# Altium project RYA_ESC.PrjPcb (part 2 of 2)

## Sheet StepDown.SchDoc
size B; SheetNumber: 10; SheetTotal: 15; SPICEModelCacheKQMKTCIF: <root> / <DocumentId>KQMKTCIF</DocumentId> / </root>
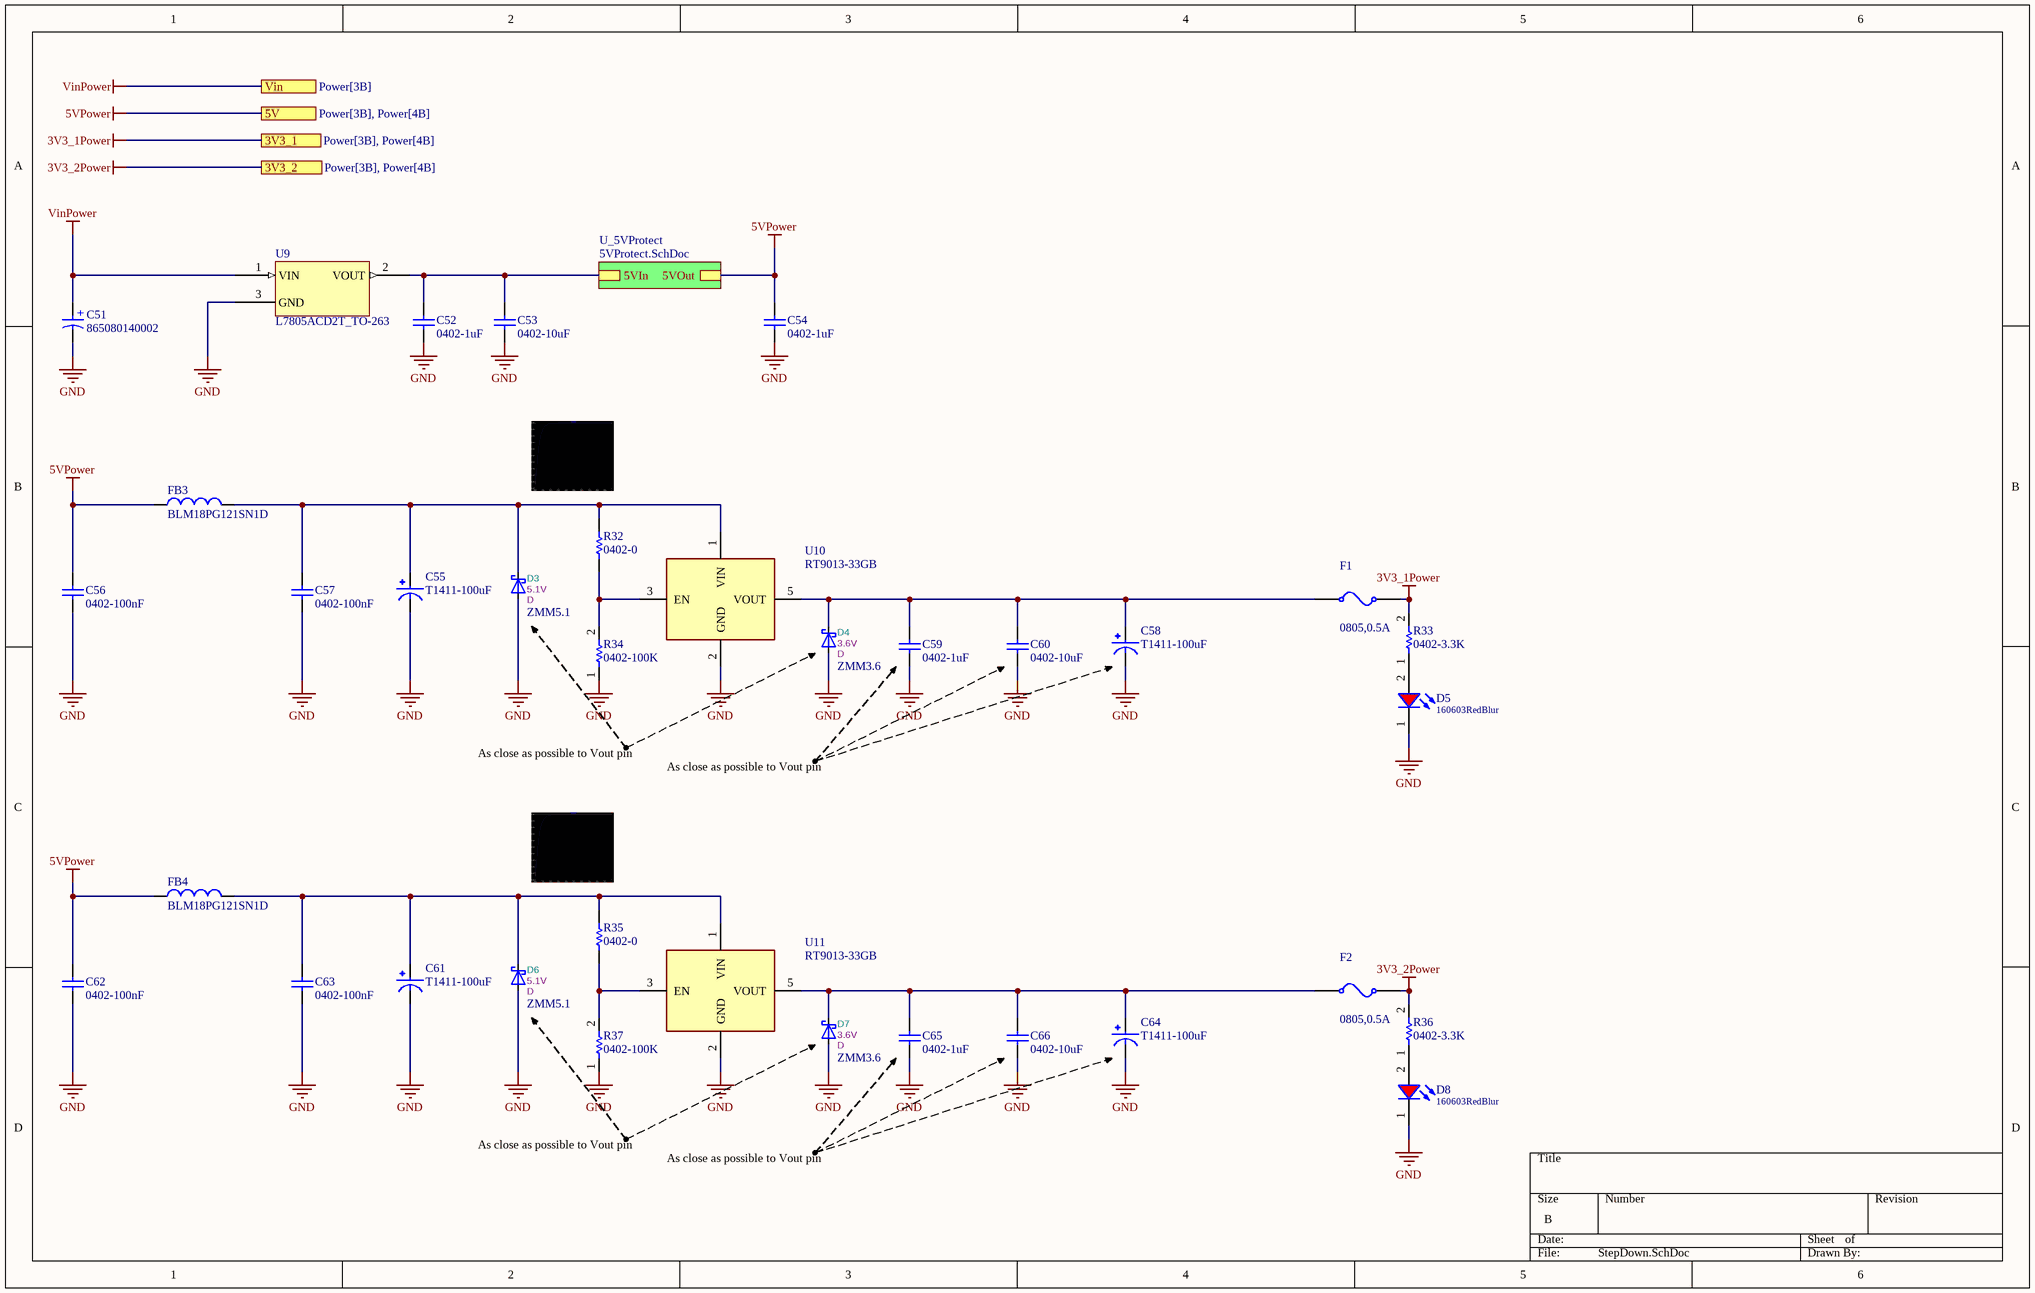
[diagram p8: StepDown.SchDoc]

### Parts
C51  865080140002  [WCAP-ASLI_D4H5.5]
C52  0402-1uF  [CAPC0402(1005)60_N]
C53  0402-10uF  [CAPC0402(1005)60_N]
C54  0402-1uF  [CAPC0402(1005)60_N]
C55  T1411-100uF  [CAPPC3528X210N]
C56  0402-100nF  [CAPC0402(1005)60_N]
C57  0402-100nF  [CAPC0402(1005)60_N]
C58  T1411-100uF  [CAPPC3528X210N]
C59  0402-1uF  [CAPC0402(1005)60_N]
C60  0402-10uF  [CAPC0402(1005)60_N]
C61  T1411-100uF  [CAPPC3528X210N]
C62  0402-100nF  [CAPC0402(1005)60_N]
C63  0402-100nF  [CAPC0402(1005)60_N]
C64  T1411-100uF  [CAPPC3528X210N]
C65  0402-1uF  [CAPC0402(1005)60_N]
C66  0402-10uF  [CAPC0402(1005)60_N]
D3  ZMM5.1  value 5.1V  Reference: D  [SOD-80_MiniMELF_Glass]
D4  ZMM3.6  value 3.6V  Reference: D  [SOD-80_MiniMELF_Glass]
D5  160603RedBlur  [WL-SMCW_0603_H=0.7mm]
D6  ZMM5.1  value 5.1V  Reference: D  [SOD-80_MiniMELF_Glass]
D7  ZMM3.6  value 3.6V  Reference: D  [SOD-80_MiniMELF_Glass]
D8  160603RedBlur  [WL-SMCW_0603_H=0.7mm]
F1  0805,0.5A  [Fuse_SMD_0805]
F2  0805,0.5A  [Fuse_SMD_0805]
FB3  BLM18PG121SN1D  [FP-BLM18-0_15-t0_8-MFG]
FB4  BLM18PG121SN1D  [FP-BLM18-0_15-t0_8-MFG]
R32  0402-0  [R-0402-1K]
R33  0402-3.3K  [R-0402-10K]
R34  0402-100K  [R-0402-10K]
R35  0402-0  [R-0402-1K]
R36  0402-3.3K  [R-0402-10K]
R37  0402-100K  [R-0402-10K]
U9  L7805ACD2T_TO-263  [TO-263]
U10  RT9013-33GB  [SOT94P279X129-5N]
U11  RT9013-33GB  [SOT94P279X129-5N]

### Sub-sheets
U_5VProtect = 5VProtect.SchDoc: 5VIn, 5VOut

### Ports
3V3_1 (see Power[3B], Power[4B]), 3V3_2 (see Power[3B], Power[4B]), 5V (see Power[3B], Power[4B]), Vin (see Power[3B])

### Nets
3V3_1Power: F1.1 R33.2 ; port 3V3_1
3V3_2Power: F2.1 R36.2 ; port 3V3_2
5VPower: C54.2 C56.2 C62.2 FB3.1 FB4.1 ; port 5V, sheet U_5VProtect/5VOut
GND: C51.2(N) C52.1 C53.1 C54.1 C55.2 C56.1 C57.1 C58.2 C59.1 C60.1 C61.2 C62.1 C63.1 C64.2 C65.1 C66.1 D3.A D4.A D5.1(K) D6.A D7.A D8.1(K) R34.1 R37.1 U9.3(GND) U10.2(GND) U11.2(GND)
VinPower: C51.1(P) U9.1(VIN) ; port Vin
NetC52_2: C52.2 C53.2 U9.2(VOUT) ; sheet U_5VProtect/5VIn
NetC55_1: C55.1 C57.2 D3.K FB3.2 R32.2 U10.1(VIN)
NetC58_1: C58.1 C59.2 C60.2 D4.K F1.0 U10.5(VOUT)
NetC61_1: C61.1 C63.2 D6.K FB4.2 R35.2 U11.1(VIN)
NetC64_1: C64.1 C65.2 C66.2 D7.K F2.0 U11.5(VOUT)
NetD5_2: D5.2(A) R33.1
NetD8_2: D8.2(A) R36.1
NetR32_1: R32.1 R34.2 U10.3(EN)
NetR35_1: R35.1 R37.2 U11.3(EN)

### Notes on the sheet
- As close as possible to Vout pin
- (in symbol CMP-014-00008-1) +

### Library data of the parts
C51 = CMP-014-00008-1: V-Chip, D4 x H5.8mm, 47uF, 6.3V; Manufacturer: Wurth Elektronik; Endurance: 2000h; Leakage Current: 3uA; Ripple Current: 86mA; Dissipation Factor: 24%; Capacitance Tolerance: +/-20%; Capacitance: 47µF; Pins: 2; Supplier 2 URL: N/A; Diameter: 4mm; Design Item ID: 865080140002; Supplier 1 SN: 710-865080140002; Operating Temperature Max: 105°C; Supplier 1 Name: Mouser; Source: Al_Cap.SchLib; Packaging: Tape and Reel; Supplier 2 Name: Digi-Key; Supplier 3 Name: thegioiic; Manufacturer Part Number: N/A; Supplier 2 SN: N/A; Rated Voltage (DC): 6.3V; Height: 5.5mm; Operating Temperature Min: -55°C; Value: 47uF, 6.3V; Supplier 1 URL: https://www.mouser.vn/ProductDetail/Wurth-Elektronik/865080140002?qs=0KOYDY2FL2%252BjKlezJ2boQA%3D%3D; Supplier 3 URL: https://www.thegioiic.com/tu-nhom-smd-47uf-6-3v-5x5-4mm; Category: Aluminum Electrolytic Capacitors; Mount: Surface Mount; Supplier 3 SN: EEEHB0J330AR; Component Type: Standard
C52 C54 C59 C65 = CMP-001-00353-3: Capacitor 1uF 0402s; Voltage Rating: 4V; Value: 1µF; Tolerance: 20%; Dielectric: X5R; Pins: 2; Component Type: Standard; Packaging: Tape and Reel; Min Operating Temperature: -55°C; Voltage Rating (DC): 4V; Series: M; Height: 0.5mm; RoHS Compliant: Yes; Case/Package: 0402; Thickness: 0.028inch; Design Item ID: CMP-1034-02139-2; Length: 0.039inch; Max Operating Temperature: 85°C; Termination: SMD/SMT; Package Quantity: 1; Width: 0.02inch; Halogen Free: Halogen Free; Source: 0402-10uF.SchLib; Construction: Flat; Mount: Surface Mount; Case Code (Metric): 1005
C53 C60 C66 = CMP-001-00352-3: Capacitor 10uF 0402s; Tolerance: 20%; Value: 10µF; Dielectric: X5R; Voltage Rating (DC): 4V; Width: 0.02inch; Packaging: Tape and Reel; RoHS Compliant: Yes; Series: M; Mount: Surface Mount; Termination: SMD/SMT; Source: 0402-10uF.SchLib; Design Item ID: CMP-1034-02139-2; Min Operating Temperature: -55°C; Construction: Flat; Component Type: Standard; Case Code (Metric): 1005; Length: 0.039inch; Height: 0.5mm; Pins: 2; Thickness: 0.028inch; Voltage Rating: 4V; Package Quantity: 1; Max Operating Temperature: 85°C; Halogen Free: Halogen Free; Case/Package: 0402
C55 C58 C61 C64 = CMP-001-00373-1: 100µF Molded Tantalum Polymer Capacitor 25 V 1411 (3528 Metric), 1210 150mOhm @ 100kHz; MF: AVX; MP: TCJB106M025R0150; Check_prices: https://www.snapeda.com/parts/TCJB106M025R0150/AVX/view-part/?ref=eda; Component Type: Standard; Value: 100µF; SnapEDA_Link: https://www.snapeda.com/parts/TCJB106M025R0150/AVX/view-part/?ref=snap; Pins: 2; Case/Package: 1210 AVX; Design Item ID: TCJB106M025R0150; Source: TCJB106M025R0150.SchLib
C56 C57 C62 C63 = CMP-001-00354-3: Capacitor 100nF 0402; Tolerance: 20%; Voltage Rating (DC): 4V; Dielectric: X5R; Series: M; RoHS Compliant: Yes; Max Operating Temperature: 85°C; Length: 0.039inch; Thickness: 0.028inch; Mount: Surface Mount; Min Operating Temperature: -55°C; Height: 0.5mm; Packaging: Tape and Reel; Construction: Flat; Termination: SMD/SMT; Source: 0402-10uF.SchLib; Design Item ID: CMP-1034-02139-2; Case/Package: 0402; Voltage Rating: 4V; Pins: 2; Value: 100nF; Width: 0.02inch; Component Type: Standard; Package Quantity: 1; Halogen Free: Halogen Free; Case Code (Metric): 1005
D3 D6 = CMP-004-00117-3: ki_keywords: Zener; Design Item ID: Zener; Pins: 2; Datasheet: https://diotec.com/de/produktliste/SBD.html; Component Type: Standard; Source: schottky-diode.SchLib; ki_description: Zener
D4 D7 = CMP-004-00123-1: ZenerDiode 3.6V; ki_description: Zener; Pins: 2; Design Item ID: Zener; Component Type: Standard; Source: schottky-diode.SchLib; ki_keywords: Zener; Datasheet: https://diotec.com/de/produktliste/SBD.html
D5 D8 = CMP-004-00093-1: WL-SMCW SMT Mono-color Chip LED Blur, size 0603, Red, 2V, 140deg; Value: Red, 2V; ComponentLink2URL: https://www.mouser.vn/ProductDetail/ROHM-Semiconductor/CSL1901VW1?qs=vvQtp7zwQdNmrXZcE27xEA%3D%3D; Supplier 2 URL: https://www.digikey.com/en/products/detail/rohm-semiconductor/SML-D12U8WT86/1641799; Pins: 2; Supplier 2 Name: Digi-Key; ComponentLink1Description: Datasheet link; ComponentLink3URL: https://www.digikey.com/en/products/detail/rohm-semiconductor/SML-D12U8WT86/1641799; Supplier 1 Name: Mouser; Supplier 1 SN: 755-CSL1901VW1; Size: 0603; ComponentLink1URL: N/A; Source: WL-SMCW_0603.SchLib; ComponentLink3Description: Supplier 2 URL; Type: Blur; Design Item ID: 160603RedBlur; Component Type: Standard; ComponentLink4URL: N/A; Supplier 3 Name: ICDayRoi; Supplier 3 SN: N/A; Color: Red; Supplier 1 URL: https://www.mouser.vn/ProductDetail/ROHM-Semiconductor/CSL1901VW1?qs=vvQtp7zwQdNmrXZcE27xEA%3D%3D; Supplier 2 SN: 511-1580-2-ND; ComponentLink2Description: Supplier 1 URL; Supplier 3 URL: N/A; ComponentLink4Description: Supplier 3 URL
F1 F2 = CMP-005-00046-1: Resettable Fuse, Size 0805, 6V, 0.5A; Manufacturer: Littelfuse; Threshold Current: 100A; Trip Current: 1A; Supplier 1 Name: Mouser; ComponentLink3URL: https://www.digikey.com/en/products/detail/littelfuse-inc/0805L050WR/1212822?s=N4IgTCBcDaIAwA44FYAyK4HUBKACEAugL5A; Component Type: Standard; Design Item ID: 060805050006; ComponentLink1Description: Datasheet link; ComponentLink2Description: Supplier 1 URL; Supplier 2 Name: Digi-Key; ComponentLink4URL: https://www.thegioiic.com/0805l050wr-cau-chi-tu-phuc-hoi-0805-6v-500ma; Size: 0805; Hold Current: 0.5A; Supplier 2 URL: https://www.mouser.vn/ProductDetail/Littelfuse/0805L050WR?qs=SJZ%252BTX%252BI2BS1ufZ22HRodg%3D%3D; Supplier 2 SN: F2772TR-ND; Threshold Voltage: 6V; ComponentLink4Description: Supplier 3 URL; Source: Fuse_SMD.SchLib; Supplier 3 SN: 0805L050WR; ComponentLink3Description: Supplier 2 URL; Mounting Technology: SMT/SMD; Supplier 3 Name: thegioiic; ComponentLink1URL: https://www.littelfuse.com/~/media/electronics/datasheets/resettable_ptcs/littelfuse_ptc_0805l_datasheet.pdf.pdf; Supplier 3 URL: https://www.thegioiic.com/0805l050wr-cau-chi-tu-phuc-hoi-0805-6v-500ma; Supplier 1 SN: 576-0805L050; ComponentLink2URL: https://www.mouser.vn/ProductDetail/Littelfuse/0805L050WR?qs=SJZ%252BTX%252BI2BS1ufZ22HRodg%3D%3D; Supplier 1 URL: https://www.mouser.vn/ProductDetail/Littelfuse/0805L050WR?qs=SJZ%252BTX%252BI2BS1ufZ22HRodg%3D%3D; Value: 6V,  0.5A; Pins: 2
FB3 FB4 = CMP-006-00234-2: Ferrite Chip, 1 Function(s), 2A, 2 Pin(s); DC Resistance-Max: 50mR; Max Operating Temperature: 125°C; Packaging: Tape and Reel; Material: Ferrite; Min Operating Temperature: -55°C; RoHS Compliant: Yes; Current Rating: 2A; Height: 0.8mm; Length: 1.6mm; Width: 0.8mm
R32 R35 = CMP-009-00678-4: 0402Resistor 0 Ohm; Value: 0
R33 R36 = CMP-009-00688-1: RES 0402 3.3K; Value: 3.3k
R34 R37 = CMP-009-00683-1: RES 0402 100K; Value: 100k
U9 = CMP-098-000007-1: Out: 5V, 1.5A; In: 7V to 35V; Pacakge: TO-263; Supplier 2 URL: https://www.digikey.com/en/products/detail/stmicroelectronics/L7805ACD2T-TR/1038230; Supplier 2 SN: 497-7253-2-ND; Package: TO-263; Component Type: Standard; Voltage Input Maximum: 7V to 35V; Output Current: 1.5A; Design Item ID: L7805ACD2T_TO-263; Supplier 3 SN: N/A; ComponentLink4Description: Supplier 3 URL; ComponentLink4URL: https://www.thegioiic.com/l7805acd2t-ic-on-ap-5v-1-5a; Supplier 1 URL: https://www.mouser.com/ProductDetail/STMicroelectronics/L7805ACD2T-TR?qs=Ctxo64yJVFuOLXlPPZdJUQ%3D%3D; Supplier 3 URL: https://www.thegioiic.com/l7805acd2t-ic-on-ap-5v-1-5a; Value: 5V, 1.5A; Pin Count: 3; Supplier 2 Name: Digi-Key; ComponentLink1Description: Datasheet link; Voltage Output: 5V; ComponentLink3Description: Supplier 2 URL; Supplier 1 SN: 511-L7805ACD2T-TR; ComponentLink3URL: https://www.digikey.com/en/products/detail/stmicroelectronics/L7805ACD2T-TR/1038230; Supplier 3 Name: thegioiic; ComponentLink2URL: https://www.mouser.com/ProductDetail/STMicroelectronics/L7805ACD2T-TR?qs=Ctxo64yJVFuOLXlPPZdJUQ%3D%3D; Source: 78xx.SchLib; ComponentLink2Description: Supplier 1 URL; Supplier 1 Name: Mouser; ComponentLink1URL: https://www.st.com/resource/en/datasheet/l78.pdf
U10 U11 = CMP-149-000001-2: Linear Voltage Regulator IC Positive Fixed 1 Output 500mA TSOT-23-5; MF: Richtek USA; Design Item ID: RT9013-33GB; SnapEDA_Link: https://www.snapeda.com/parts/RT9013-33GB/Richtek/view-part/?ref=snap; Source: RT9013-33GB.SchLib; Component Type: Standard; Pin Count: 4; Check_prices: https://www.snapeda.com/parts/RT9013-33GB/Richtek/view-part/?ref=eda; MP: RT9013-33GB; Package: SOT-23-5 Richtek; Value: *

## Sheet 5VProtect.SchDoc
size B; SheetNumber: 11; SheetTotal: 15
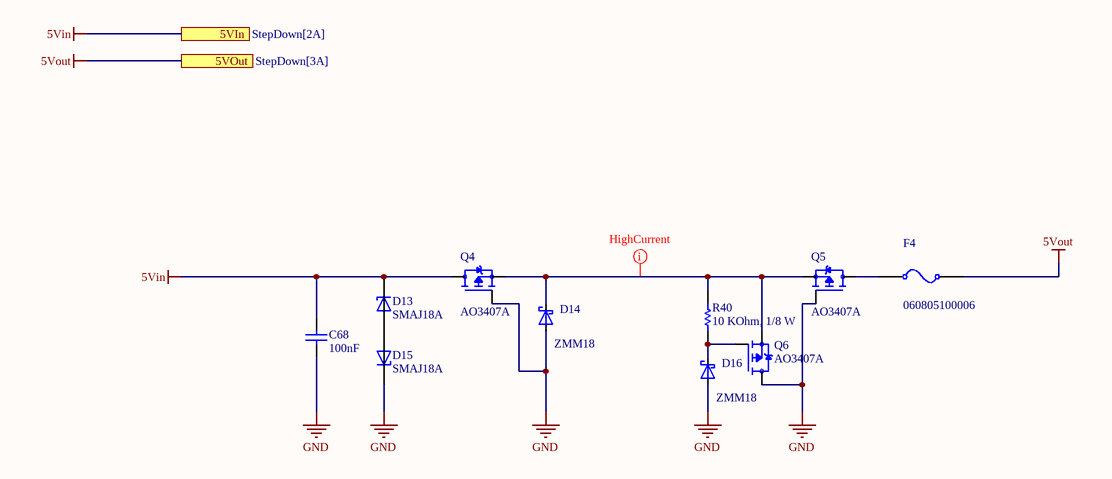
[diagram p9: 5VProtect.SchDoc]

### Parts
C68  value 100nF  [CAP_0805]  (hidden comment: 0108051041050)
D13  SMAJ18A  [DIOM4325X250N]
D14  ZMM18  [SOD-80_MiniMELF_Glass]
D15  SMAJ18A  [DIOM4325X250N]
D16  ZMM18  [SOD-80_MiniMELF_Glass]
F4  060805100006  [Fuse_SMD_0805]
Q4  AO3407A  [SOT95P280X125-3N]
Q5  AO3407A  [SOT95P280X125-3N]
Q6  AO3407A  [SOT95P280X125-3N]
R40  value 10 KOhm, 1/8 W  [RESISTOR_0805]  (hidden comment: 0008051031)

### Ports
5VIn (see StepDown[2A]), 5VOut (see StepDown[3A])

### Nets
5Vin: C68.2 D13.C Q4.3(D) ; port 5VIn
5Vout: F4.1 ; port 5VOut
GND: C68.1 D14.A D15.C D16.A Q4.1(G) Q5.1(G) Q6.3(D)
NetD13_A: D13.A D15.A
NetD14_K: D14.K Q4.2(S) Q5.2(S) Q6.2(S) R40.2
NetD16_K: D16.K Q6.1(G) R40.1
NetF4_0: F4.0 Q5.3(D)

### Layout directives
rule Width Constraint [Pref Width = 0.508mm    Min Width = 0.127mm    Max Width = 25.4mm]: NetD14_K

### Library data of the parts
C68 = CMP-001-00259-1: CAP, size 0805, 0.1 nF, 50 VDC; Manufacture Name: TDK; Manufacture SN: CGA4J2X8R1H104K125AD; Voltage Rating DC: 50 VDC; Tolerance: 10%; Pins: 2; Supplier 2 URL: https://www.digikey.com/en/products/detail/tdk-corporation/cga4j2x8r1h104k125ad/3248169; Supplier 1 SN: 810-C2012X8R1H104KEP; Supplier 1 Name: Mouser; Supplier 3 Name: thegioiic; Mounting Technology: SMT; Source: Capacitor_0805_10_percent.SchLib; Supplier 2 SN: 445-8810-2-ND; Supplier 3 SN: OEM; Operating Temperature: -55 to +125degC; Supplier 2 Name: Digi-Key; Component Type: Standard; Design Item ID: 0108051041050; Supplier 1 URL: https://www.mouser.vn/ProductDetail/TDK/CGA4J2X8R1H104K125AD?qs=LcTL%2F5vFEzExqZqv3rh1qQ%3D%3D&utm_source=mouser-refine-download&utm_medium=file&utm_campaign=CGA4J2X8R1H104K125AD&utm_content=TDK; Supplier 3 URL: N/A; Packaging: Tape and Reel; Size: 0805
D13 D15 = CMP-004-00085-1: 400W, 21.1V, 5%, Unidirectional, TVS; MF: Taiwan Semiconductor; SnapEDA_Link: https://www.snapeda.com/parts/SMAJ18A/taiwan/view-part/?ref=snap; Value: *; Component Type: Standard; Case/Package: SMA-2 Taiwan Semiconductor; Check_prices: https://www.snapeda.com/parts/SMAJ18A/taiwan/view-part/?ref=eda; Source: SMAJ18A.SchLib; Design Item ID: SMAJ18A; Pins: 2; MP: SMAJ18A
D14 D16 = CMP-004-00086-2: Value: Shottky-Diode; Reference: D; ki_keywords: Schottky; ki_description: Schottky Diode; Component Type: Standard; Pins: 2; Source: schottky-diode.SchLib; Design Item ID: Schottky-Diode; Datasheet: https://diotec.com/de/produktliste/SBD.html
F4 = CMP-005-00047-1: Resettable Fuse, Size 0805, 6V, 1A; Manufacturer: Littelfuse; Value: 6V,  1A; Threshold Current: 40A; Trip Current: 1.95A; Mounting Technology: SMT/SMD; Supplier 1 URL: https://www.mouser.vn/ProductDetail/Littelfuse/0805L100WR?qs=SJZ%252BTX%252BI2BTMlREVsW49pQ%3D%3D; Supplier 3 Name: thegioiic; Supplier 3 URL: https://www.thegioiic.com/0805l100wr-cau-chi-tu-phuc-hoi-0805-6v-1a; Supplier 3 SN: 0805L100WR; ComponentLink1URL: https://www.littelfuse.com/~/media/electronics/datasheets/resettable_ptcs/littelfuse_ptc_0805l_datasheet.pdf.pdf; Pins: 2; Supplier 1 SN: 576-0805L100; Component Type: Standard; Design Item ID: 060805100006; Threshold Voltage: 6V; ComponentLink1Description: Datasheet link; ComponentLink4Description: Supplier 3 URL; Supplier 1 Name: Mouser; Supplier 2 URL: https://www.mouser.vn/ProductDetail/Littelfuse/0805L100WR?qs=SJZ%252BTX%252BI2BTMlREVsW49pQ%3D%3D; Supplier 2 Name: Digi-Key; ComponentLink2URL: https://www.mouser.vn/ProductDetail/Littelfuse/0805L100WR?qs=SJZ%252BTX%252BI2BTMlREVsW49pQ%3D%3D; Hold Current: 1A; Source: Fuse_SMD.SchLib; ComponentLink3Description: Supplier 2 URL; Size: 0805; ComponentLink2Description: Supplier 1 URL; Supplier 2 SN: F2774TR-ND; ComponentLink3URL: https://www.digikey.com/en/products/detail/littelfuse-inc/0805L100WR/1212824; ComponentLink4URL: https://www.thegioiic.com/0805l100wr-cau-chi-tu-phuc-hoi-0805-6v-1a
Q4-Q6 = CMP-123-000000-1: P-Channel 30 V 4.3A (Ta) 1.4W (Ta) Surface Mount SOT-23-3; MF: Alpha &; Design Item ID: AO3407A; Check_prices: https://www.snapeda.com/parts/AO3407A/Alpha/view-part/?ref=eda; SnapEDA_Link: https://www.snapeda.com/parts/AO3407A/Alpha/view-part/?ref=snap; Source: AO3407A.SchLib; Pin Count: 3; Package: SOT-23 Alpha &amp; Omega Semiconductor; Value: *; Component Type: Standard; MP: AO3407A
R40 = CMP-009-00482-1: RES, size 0805, 10 KOhm, 1/8 W; Manufacture  Name: Vishay Dale; Manufacture  SN: CRCW080515K0FKEAC; Rated Power: 1/8 W; Resistance Tolerance: +/-1%; ComponentLink3URL: https://www.digikey.com/en/products/detail/vishay-dale/CRCW080515K0FKEAC/7928558; Supplier 3 SN: N/A; ComponentLink1URL: https://www.vishay.com/docs/28773/crcwce3.pdf; ComponentLink2Description: Supplier 1 URL; Mounting Technology: SMT; Supplier 1 SN: 71-CRCW0805-15K-E3; ComponentLink3Description: Supplier 2 URL; Pins: 2; Size: 0805; ComponentLink1Description: Datasheet link; Supplier 3 URL: N/A; Source: Resistor_0805.SchLib; Supplier 2 URL: https://www.digikey.com/en/products/detail/vishay-dale/CRCW080515K0FKEAC/7928558; ComponentLink4URL: N/A; Supplier 1 URL: https://www.mouser.vn/ProductDetail/Vishay-Dale/CRCW080515K0FKEA?qs=bMjB6bAaLEM4rXT2DoR3BA%3D%3D; Supplier 1 Name: Mouser; Design Item ID: 0008051531; Supplier 2 SN: 541-4136-2-ND; Component Type: Standard; ComponentLink2URL: https://www.mouser.vn/ProductDetail/Vishay-Dale/CRCW080515K0FKEA?qs=bMjB6bAaLEM4rXT2DoR3BA%3D%3D; Supplier 2 Name: Digi-Key; ComponentLink4Description: Supplier 3 URL; Supplier 3 Name: Thegioiic

## Sheet BattVoltSense.SchDoc
size B; SheetNumber: 9; SheetTotal: 15
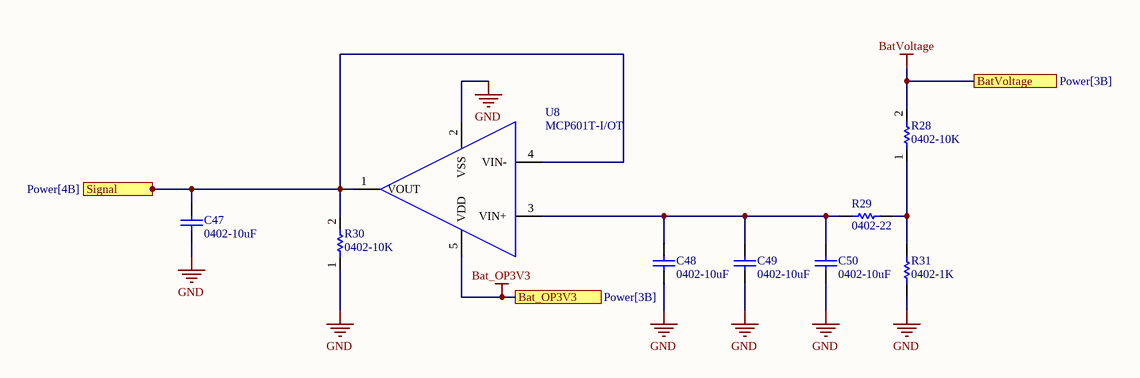
[diagram p10: BattVoltSense.SchDoc]

### Parts
C47  0402-10uF  [CAPC0402(1005)60_N]
C48  0402-10uF  [CAPC0402(1005)60_N]
C49  0402-10uF  [CAPC0402(1005)60_N]
C50  0402-10uF  [CAPC0402(1005)60_N]
R28  0402-10K  [R-0402-10K]
R29  0402-22  [R-0402-1K]
R30  0402-10K  [R-0402-10K]
R31  0402-1K  [R-0402-1K]
U8  MCP601T-I/OT  [SOT95P280X145-5N]

### Ports
Bat_OP3V3 (see Power[3B]), BatVoltage (see Power[3B]), Signal (see Power[4B])

### Nets
Bat_OP3V3: U8.5(VDD) ; port Bat_OP3V3
BatVoltage: R28.2 ; port BatVoltage
GND: C47.1 C48.1 C49.1 C50.1 R30.1 R31.1 U8.2(VSS)
NetC47_2: C47.2 R30.2 U8.1(VOUT) U8.4(VIN-) ; port Signal
NetC48_2: C48.2 C49.2 C50.2 R29.1 U8.3(VIN+)
NetR28_1: R28.1 R29.2 R31.2

### Library data of the parts
C47-C50 = CMP-001-00352-3: as C53 on sheet StepDown; Width: 0.02inch; Packaging: Tape and Reel; RoHS Compliant: Yes; Series: M; Mount: Surface Mount; Termination: SMD/SMT; Source: 0402-10uF.SchLib; Design Item ID: CMP-1034-02139-2; Min Operating Temperature: -55°C; Construction: Flat; Component Type: Standard; Case Code (Metric): 1005; Length: 0.039inch; Height: 0.5mm; Pins: 2; Thickness: 0.028inch; Voltage Rating: 4V; Package Quantity: 1; Max Operating Temperature: 85°C; Halogen Free: Halogen Free; Case/Package: 0402
R28 R30 = CMP-009-00675-4: RES 0402 10K; Value: 10k
R29 = CMP-009-00695-1: 0402Resistor 22Ohm; Value: 22
R31 = CMP-009-00674-3: 0402Resistor 1K Ohm; Value: 1k
U8 = CMP-014-00080-5: General Purpose Amplifier 1 Circuit Rail-to-Rail SOT-23-5; MF: Microchip; Price: None; Design Item ID: MCP601T-I/OT; Pins: 5; Case/Package: SOT-23 Microchip; Component Type: Standard; SnapEDA_Link: https://www.snapeda.com/parts/MCP601T-I/OT/Microchip/view-part/43729/?ref=snap; Value: *; Source: SnapEDAsch.SchLib; MP: MCP601T-I/OT; Availability: Unavailable

## Sheet Driver.SchDoc
size B; SheetNumber: 4; SheetTotal: 15
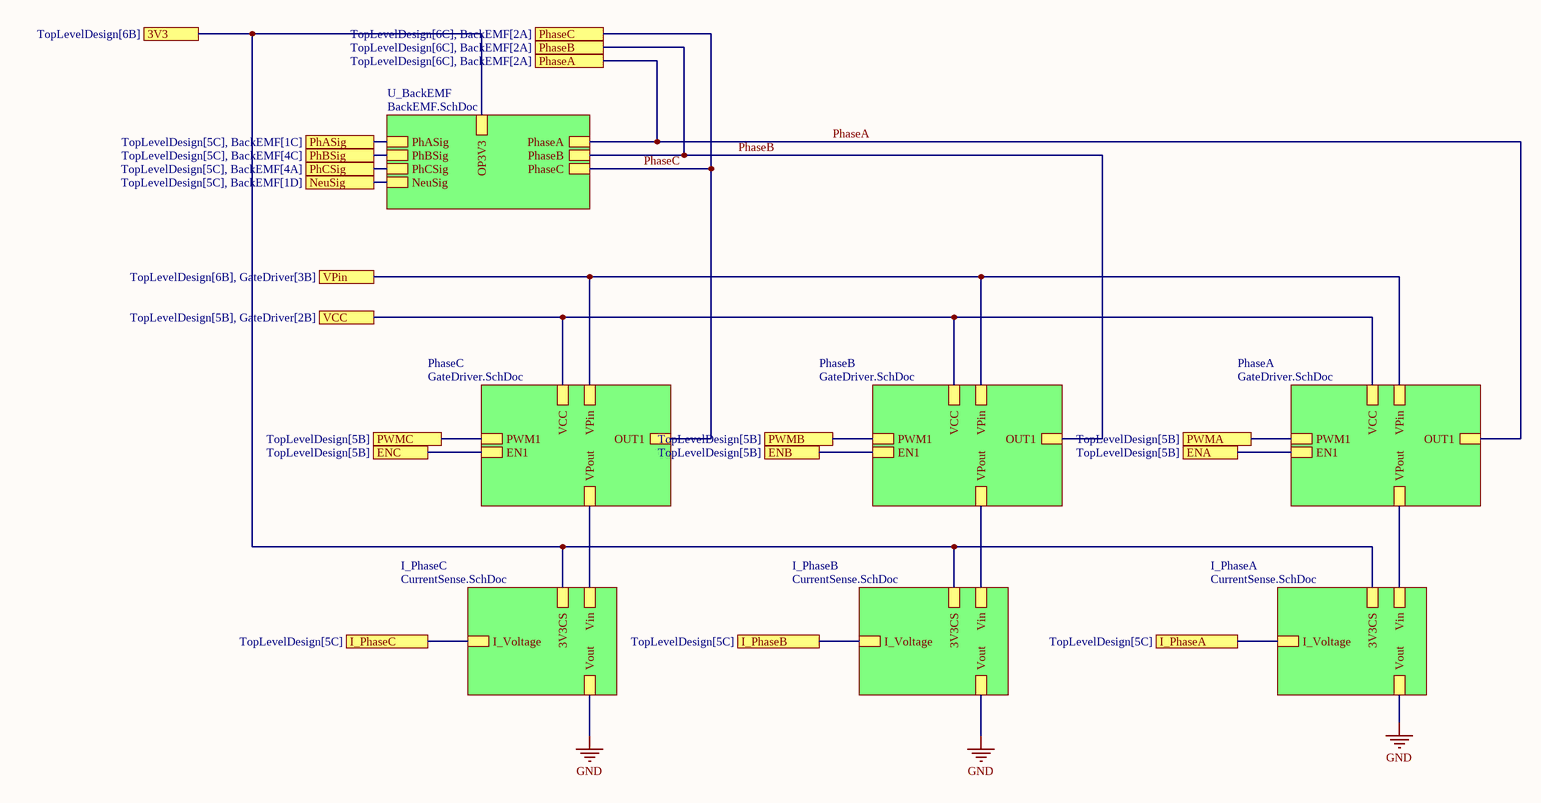
[diagram p11: Driver.SchDoc]

### Sub-sheets
I_PhaseA = CurrentSense.SchDoc: Vout, Vin, I_Voltage, 3V3CS
I_PhaseB = CurrentSense.SchDoc: Vout, Vin, I_Voltage, 3V3CS
I_PhaseC = CurrentSense.SchDoc: Vout, Vin, I_Voltage, 3V3CS
PhaseA = GateDriver.SchDoc: PWM1, OUT1, EN1, VPin, VCC, VPout
PhaseB = GateDriver.SchDoc: PWM1, OUT1, EN1, VPin, VCC, VPout
PhaseC = GateDriver.SchDoc: PWM1, OUT1, EN1, VPin, VCC, VPout
U_BackEMF = BackEMF.SchDoc: PhaseA, PhaseB, PhaseC, PhCSig, PhBSig, PhASig, NeuSig, OP3V3

### Ports
3V3 (see TopLevelDesign[6B]), ENA (see TopLevelDesign[5B]), ENB (see TopLevelDesign[5B]), ENC (see TopLevelDesign[5B]), I_PhaseA (see TopLevelDesign[5C]), I_PhaseB (see TopLevelDesign[5C]), I_PhaseC (see TopLevelDesign[5C]), NeuSig (see TopLevelDesign[5C], BackEMF[1D]), PhaseA (see TopLevelDesign[6C], BackEMF[2A]), PhaseB (see TopLevelDesign[6C], BackEMF[2A]), PhaseC (see TopLevelDesign[6C], BackEMF[2A]), PhASig (see TopLevelDesign[5C], BackEMF[1C]), PhBSig (see TopLevelDesign[5C], BackEMF[4C]), PhCSig (see TopLevelDesign[5C], BackEMF[4A]), PWMA (see TopLevelDesign[5B]), PWMB (see TopLevelDesign[5B]), PWMC (see TopLevelDesign[5B]), VCC (see TopLevelDesign[5B], GateDriver[2B]), VPin (see TopLevelDesign[6B], GateDriver[3B])

### Nets
GND: sheet I_PhaseB/Vout, sheet I_PhaseC/Vout, sheet I_PhaseA/Vout
VCC: port VCC, sheet PhaseB/VCC, sheet PhaseC/VCC, sheet PhaseA/VCC
Wifi3V3: port 3V3, sheet I_PhaseB/3V3CS, sheet I_PhaseC/3V3CS, sheet I_PhaseA/3V3CS, sheet U_BackEMF/OP3V3
PhaseA: port PhaseA, sheet U_BackEMF/PhaseA, sheet PhaseA/OUT1
PhaseB: port PhaseB, sheet U_BackEMF/PhaseB, sheet PhaseB/OUT1
PhaseC: port PhaseC, sheet U_BackEMF/PhaseC, sheet PhaseC/OUT1
NetC25_2: port PhCSig, sheet U_BackEMF/PhCSig
NetC32_2: port PhASig, sheet U_BackEMF/PhASig
NetC33_2: port PhBSig, sheet U_BackEMF/PhBSig
NetC36_2: port NeuSig, sheet U_BackEMF/NeuSig
NetQ7_PhaseA_4: port VPin, sheet PhaseB/VPin, sheet PhaseC/VPin, sheet PhaseA/VPin
(unnamed): port PWMC, sheet PhaseC/PWM1
(unnamed): port ENC, sheet PhaseC/EN1
(unnamed): port PWMB, sheet PhaseB/PWM1
(unnamed): port ENB, sheet PhaseB/EN1
(unnamed): port PWMA, sheet PhaseA/PWM1
(unnamed): port ENA, sheet PhaseA/EN1
(unnamed): port I_PhaseC, sheet I_PhaseC/I_Voltage
(unnamed): port I_PhaseB, sheet I_PhaseB/I_Voltage
(unnamed): port I_PhaseA, sheet I_PhaseA/I_Voltage
(unnamed): sheet I_PhaseB/Vin, sheet PhaseB/VPout
(unnamed): sheet I_PhaseC/Vin, sheet PhaseC/VPout
(unnamed): sheet I_PhaseA/Vin, sheet PhaseA/VPout

## Sheet CurrentSense.SchDoc
size B; SheetNumber: 6; SheetTotal: 15
Used 3 times, as channels U_TopLevelDesign/U_Driver/I_PhaseB, U_TopLevelDesign/U_Driver/I_PhaseC, U_TopLevelDesign/U_Driver/I_PhaseA. Parts and nets are listed once, with the designators drawn on the sheet.
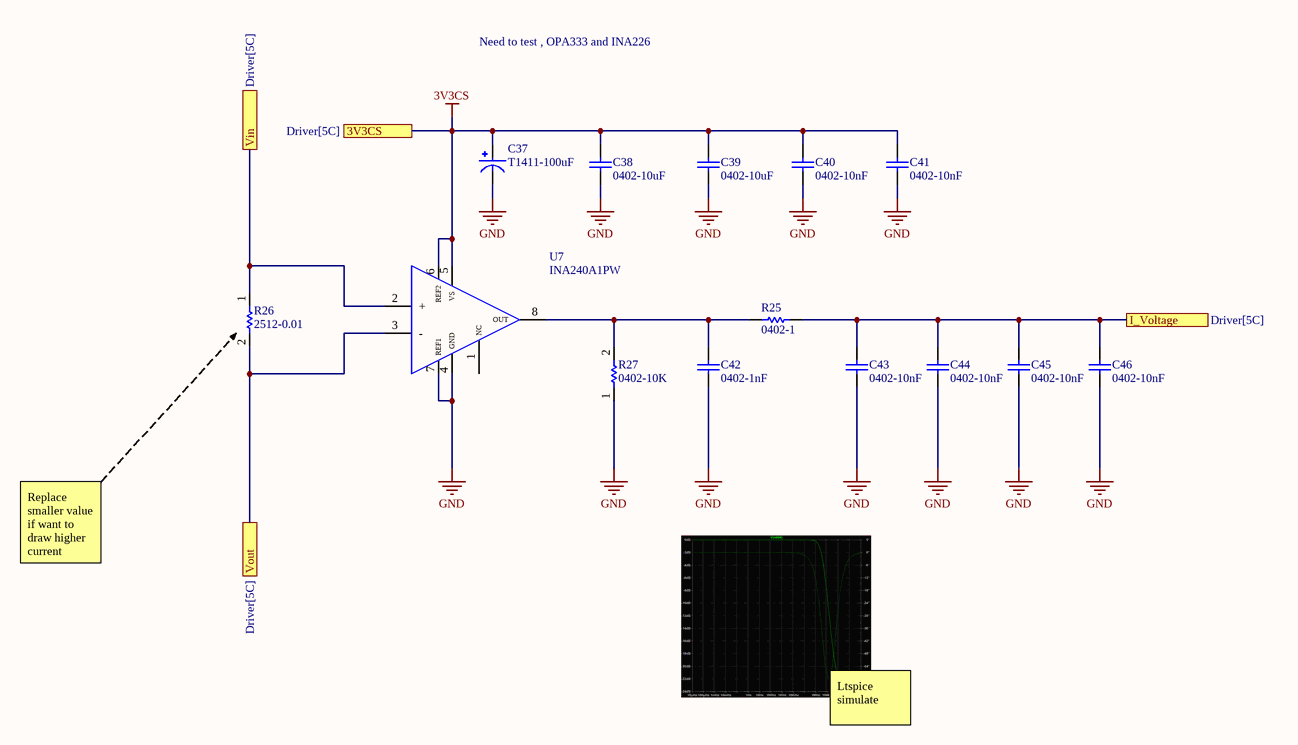
[diagram p12: CurrentSense.SchDoc]

### Parts
C37  T1411-100uF  [CAPPC3528X210N]
C38  0402-10uF  [CAPC0402(1005)60_N]
C39  0402-10uF  [CAPC0402(1005)60_N]
C40  0402-10nF  [CAPC0402(1005)60_N]
C41  0402-10nF  [CAPC0402(1005)60_N]
C42  0402-1nF  [CAPC0402(1005)60_N]
C43  0402-10nF  [CAPC0402(1005)60_N]
C44  0402-10nF  [CAPC0402(1005)60_N]
C45  0402-10nF  [CAPC0402(1005)60_N]
C46  0402-10nF  [CAPC0402(1005)60_N]
R25  0402-1  [R-0402-1K]
R26  2512-0.01  [FP-WSLP2512R0100FEA-IPC_A]
R27  0402-10K  [R-0402-10K]
U7  INA240A1PW  [SOP65P640X120-8N]

### Ports
3V3CS (see Driver[5C]), I_Voltage (see Driver[5C]), Vin (see Driver[5C]), Vout (see Driver[5C])

### Nets
3V3CS: C37.1 C38.2 C39.2 C40.2 C41.2 U7.5(VS) U7.6(REF2) ; port 3V3CS
GND: C37.2 C38.1 C39.1 C40.1 C41.1 C42.1 C43.1 C44.1 C45.1 C46.1 R27.1 U7.4(GND) U7.7(REF1)
I_Voltage: C43.2 C44.2 C45.2 C46.2 R25.2 ; port I_Voltage
Vin: R26.1 U7.2(+) ; port Vin
Vout: R26.2 U7.3(-) ; port Vout
NetC42_2: C42.2 R25.1 R27.2 U7.8(OUT)

Not connected (* = marked no-connect by the designer): U7 1(NC)

### Channels
U_TopLevelDesign/U_Driver/I_PhaseB: designators end in _I_PhaseB; ports 3V3CS=3V3CS I_Voltage=NetC43_I_PhaseA_2 Vin=VinPower Vout=NetR26_I_PhaseA_2
U_TopLevelDesign/U_Driver/I_PhaseC: designators end in _I_PhaseC; ports 3V3CS=3V3CS I_Voltage=NetC43_I_PhaseA_2 Vin=VinPower Vout=NetR26_I_PhaseA_2
U_TopLevelDesign/U_Driver/I_PhaseA: designators end in _I_PhaseA; ports 3V3CS=3V3CS I_Voltage=NetC43_I_PhaseA_2 Vin=VinPower Vout=NetR26_I_PhaseA_2

### Notes on the sheet
- Need to test , OPA333 and INA226
- Replace smaller value if want to draw higher current
- Ltspice simulate

### Library data of the parts
C37 = CMP-001-00373-1: as C55 on sheet StepDown; Check_prices: https://www.snapeda.com/parts/TCJB106M025R0150/AVX/view-part/?ref=eda; Component Type: Standard; Value: 100µF; SnapEDA_Link: https://www.snapeda.com/parts/TCJB106M025R0150/AVX/view-part/?ref=snap; Pins: 2; Case/Package: 1210 AVX; Design Item ID: TCJB106M025R0150; Source: TCJB106M025R0150.SchLib
C38 C39 = CMP-001-00352-3: as C53 on sheet StepDown; Width: 0.02inch; Packaging: Tape and Reel; RoHS Compliant: Yes; Series: M; Mount: Surface Mount; Termination: SMD/SMT; Source: 0402-10uF.SchLib; Design Item ID: CMP-1034-02139-2; Min Operating Temperature: -55°C; Construction: Flat; Component Type: Standard; Case Code (Metric): 1005; Length: 0.039inch; Height: 0.5mm; Pins: 2; Thickness: 0.028inch; Voltage Rating: 4V; Package Quantity: 1; Max Operating Temperature: 85°C; Halogen Free: Halogen Free; Case/Package: 0402
C40 C41 C43-C46 = CMP-001-00355-4: Capacitor 10nF 0402; Tolerance: 20%; Dielectric: X5R; Voltage Rating (DC): 4V; Height: 0.5mm; Mount: Surface Mount; Min Operating Temperature: -55°C; Max Operating Temperature: 85°C; RoHS Compliant: Yes; Source: 0402-10uF.SchLib; Width: 0.02inch; Pins: 2; Value: 10nF; Case/Package: 0402; Halogen Free: Halogen Free; Case Code (Metric): 1005; Construction: Flat; Termination: SMD/SMT; Design Item ID: CMP-1034-02139-2; Component Type: Standard; Thickness: 0.028inch; Packaging: Tape and Reel; Series: M; Package Quantity: 1; Length: 0.039inch; Voltage Rating: 4V
C42 = CMP-001-00357-4: Capacitor 1nF 0402; Tolerance: 20%; Dielectric: X5R; Voltage Rating: 4V; Value: 1nF; Min Operating Temperature: -55°C; Component Type: Standard; Termination: SMD/SMT; Height: 0.5mm; Construction: Flat; RoHS Compliant: Yes; Voltage Rating (DC): 4V; Mount: Surface Mount; Case Code (Metric): 1005; Pins: 2; Package Quantity: 1; Max Operating Temperature: 85°C; Length: 0.039inch; Source: 0402-10uF.SchLib; Design Item ID: CMP-1034-02139-2; Case/Package: 0402; Series: M; Packaging: Tape and Reel; Halogen Free: Halogen Free; Thickness: 0.028inch; Width: 0.02inch
R25 = CMP-009-00698-1: 0402Resistor 1Ohm; Value: 1
R26 = CMP-009-00697-1: RES 0.01 OHM 1% 3W 2512; Value: 10m; Temperature Coefficient: 75ppm/°C; Height: 0.635mm; Resistance Tolerance: 1%; Case/Package: 2512; Packaging: Tape and Reel; Length: 6.4mm; Termination: SMD/SMT; Design Item ID: CMP-02407-010954-1; Pins: 2; Max Operating Temperature: 170°C; RoHS Compliant: Yes; Weight: 0.001429oz; Source: 2512.SchLib; Case Code (Metric): 6432; Package Quantity: 2000; Power Rating: 3W; Component Type: Standard; Resistor Type: Metal Strip; Series: WSLP; Min Operating Temperature: -65°C; Lead Free: Lead Free; Tolerance: 1%; Width: 3.2mm
R27 = CMP-009-00675-4: RES 0402 10K; Value: 10k
U7 = CMP-014-00085-3: -4 to 80V, bidirectional, ultra-precise current sense amplifier with enhanced PWM rejection; MF: Texas Instruments; SnapEDA_Link: https://www.snapeda.com/parts/INA240A1PW/Texas+Instruments/view-part/?ref=snap; Value: *; Case/Package: TSSOP-8 Texas Instruments; Design Item ID: INA240A1PW; Pins: 8; Check_prices: https://www.snapeda.com/parts/INA240A1PW/Texas+Instruments/view-part/?ref=eda; MP: INA240A1PW; Source: INA240A1PW.SchLib; Component Type: Standard

## Sheet BackEMF.SchDoc
size B; SheetNumber: 5; SheetTotal: 15
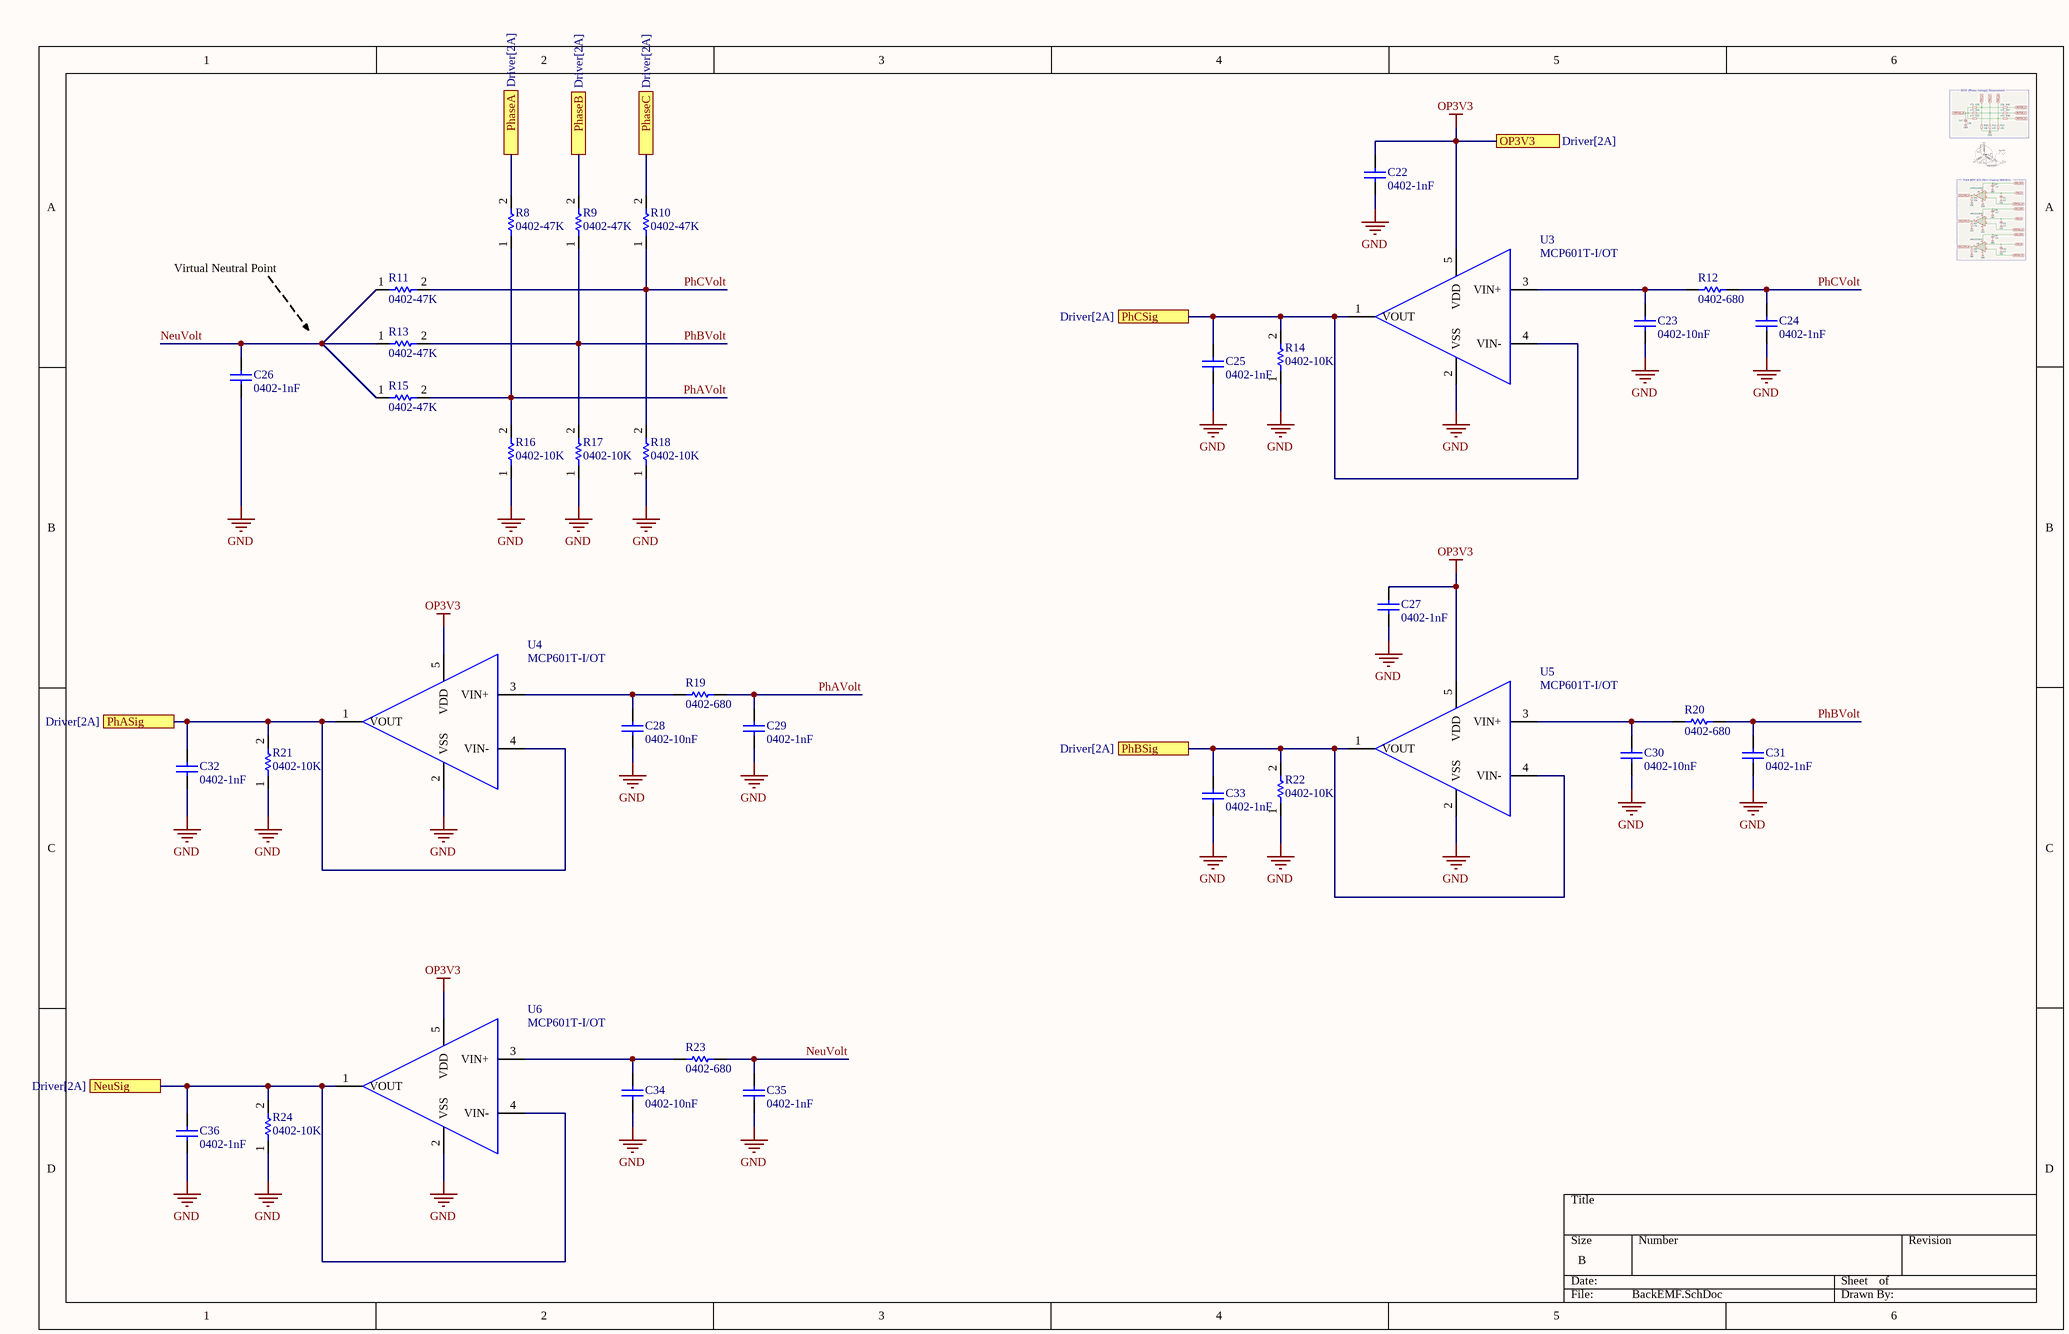
[diagram p13: BackEMF.SchDoc]

### Parts
C22  0402-1nF  [CAPC0402(1005)60_N]
C23  0402-10nF  [CAPC0402(1005)60_N]
C24  0402-1nF  [CAPC0402(1005)60_N]
C25  0402-1nF  [CAPC0402(1005)60_N]
C26  0402-1nF  [CAPC0402(1005)60_N]
C27  0402-1nF  [CAPC0402(1005)60_N]
C28  0402-10nF  [CAPC0402(1005)60_N]
C29  0402-1nF  [CAPC0402(1005)60_N]
C30  0402-10nF  [CAPC0402(1005)60_N]
C31  0402-1nF  [CAPC0402(1005)60_N]
C32  0402-1nF  [CAPC0402(1005)60_N]
C33  0402-1nF  [CAPC0402(1005)60_N]
C34  0402-10nF  [CAPC0402(1005)60_N]
C35  0402-1nF  [CAPC0402(1005)60_N]
C36  0402-1nF  [CAPC0402(1005)60_N]
R8  0402-47K  [R-0402-10K]
R9  0402-47K  [R-0402-10K]
R10  0402-47K  [R-0402-10K]
R11  0402-47K  [R-0402-10K]
R12  0402-680  [R-0402-1K]
R13  0402-47K  [R-0402-10K]
R14  0402-10K  [R-0402-10K]
R15  0402-47K  [R-0402-10K]
R16  0402-10K  [R-0402-10K]
R17  0402-10K  [R-0402-10K]
R18  0402-10K  [R-0402-10K]
R19  0402-680  [R-0402-1K]
R20  0402-680  [R-0402-1K]
R21  0402-10K  [R-0402-10K]
R22  0402-10K  [R-0402-10K]
R23  0402-680  [R-0402-1K]
R24  0402-10K  [R-0402-10K]
U3  MCP601T-I/OT  [SOT95P280X145-5N]
U4  MCP601T-I/OT  [SOT95P280X145-5N]
U5  MCP601T-I/OT  [SOT95P280X145-5N]
U6  MCP601T-I/OT  [SOT95P280X145-5N]

### Ports
NeuSig (see Driver[2A]), OP3V3 (see Driver[2A]), PhaseA (see Driver[2A]), PhaseB (see Driver[2A]), PhaseC (see Driver[2A]), PhASig (see Driver[2A]), PhBSig (see Driver[2A]), PhCSig (see Driver[2A])

### Nets
GND: C22.1 C23.1 C24.1 C25.1 C26.1 C27.1 C28.1 C29.1 C30.1 C31.1 C32.1 C33.1 C34.1 C35.1 C36.1 R14.1 R16.1 R17.1 R18.1 R21.1 R22.1 R24.1 U3.2(VSS) U4.2(VSS) U5.2(VSS) U6.2(VSS)
OP3V3: C22.2 C27.2 U3.5(VDD) U4.5(VDD) U5.5(VDD) U6.5(VDD) ; port OP3V3
NeuVolt: C26.2 C35.2 R11.1 R13.1 R15.1 R23.2
PhaseA: R8.2 ; port PhaseA
PhaseB: R9.2 ; port PhaseB
PhaseC: R10.2 ; port PhaseC
PhAVolt: C29.2 R8.1 R15.2 R16.2 R19.2
PhBVolt: C31.2 R9.1 R13.2 R17.2 R20.2
PhCVolt: C24.2 R10.1 R11.2 R12.2 R18.2
NetC23_2: C23.2 R12.1 U3.3(VIN+)
NetC25_2: C25.2 R14.2 U3.1(VOUT) U3.4(VIN-) ; port PhCSig
NetC28_2: C28.2 R19.1 U4.3(VIN+)
NetC30_2: C30.2 R20.1 U5.3(VIN+)
NetC32_2: C32.2 R21.2 U4.1(VOUT) U4.4(VIN-) ; port PhASig
NetC33_2: C33.2 R22.2 U5.1(VOUT) U5.4(VIN-) ; port PhBSig
NetC34_2: C34.2 R23.1 U6.3(VIN+)
NetC36_2: C36.2 R24.2 U6.1(VOUT) U6.4(VIN-) ; port NeuSig

### Notes on the sheet
- Virtual Neutral Point

### Library data of the parts
C22 C24-C27 C29 C31-C33 C35 C36 = CMP-001-00357-4: as C42 on sheet CurrentSense; Value: 1nF; Min Operating Temperature: -55°C; Component Type: Standard; Termination: SMD/SMT; Height: 0.5mm; Construction: Flat; RoHS Compliant: Yes; Voltage Rating (DC): 4V; Mount: Surface Mount; Case Code (Metric): 1005; Pins: 2; Package Quantity: 1; Max Operating Temperature: 85°C; Length: 0.039inch; Source: 0402-10uF.SchLib; Design Item ID: CMP-1034-02139-2; Case/Package: 0402; Series: M; Packaging: Tape and Reel; Halogen Free: Halogen Free; Thickness: 0.028inch; Width: 0.02inch
C23 C28 C30 C34 = CMP-001-00355-4: as C40 on sheet CurrentSense; Height: 0.5mm; Mount: Surface Mount; Min Operating Temperature: -55°C; Max Operating Temperature: 85°C; RoHS Compliant: Yes; Source: 0402-10uF.SchLib; Width: 0.02inch; Pins: 2; Value: 10nF; Case/Package: 0402; Halogen Free: Halogen Free; Case Code (Metric): 1005; Construction: Flat; Termination: SMD/SMT; Design Item ID: CMP-1034-02139-2; Component Type: Standard; Thickness: 0.028inch; Packaging: Tape and Reel; Series: M; Package Quantity: 1; Length: 0.039inch; Voltage Rating: 4V
R8-R11 R13 R15 = CMP-009-00680-1: RES 0402 47K; Value: 47k
R12 R19 R20 R23 = CMP-009-00691-1: 0402Resistor 680Ohm; Value: 680
R14 R16-R18 R21 R22 R24 = CMP-009-00675-4: RES 0402 10K; Value: 10k
U3-U6 = CMP-014-00080-6: General Purpose Amplifier 1 Circuit Rail-to-Rail SOT-23-5; MF: Microchip; Pins: 5; Source: SnapEDAsch.SchLib; Design Item ID: MCP601T-I/OT; Availability: Unavailable; Case/Package: SOT-23 Microchip; Price: None; SnapEDA_Link: https://www.snapeda.com/parts/MCP601T-I/OT/Microchip/view-part/43729/?ref=snap; Component Type: Standard; MP: MCP601T-I/OT; Value: *

## Sheet GateDriver.SchDoc
size B; SheetNumber: 7; SheetTotal: 15
Used 3 times, as channels U_TopLevelDesign/U_Driver/PhaseB, U_TopLevelDesign/U_Driver/PhaseC, U_TopLevelDesign/U_Driver/PhaseA. Parts and nets are listed once, with the designators drawn on the sheet.
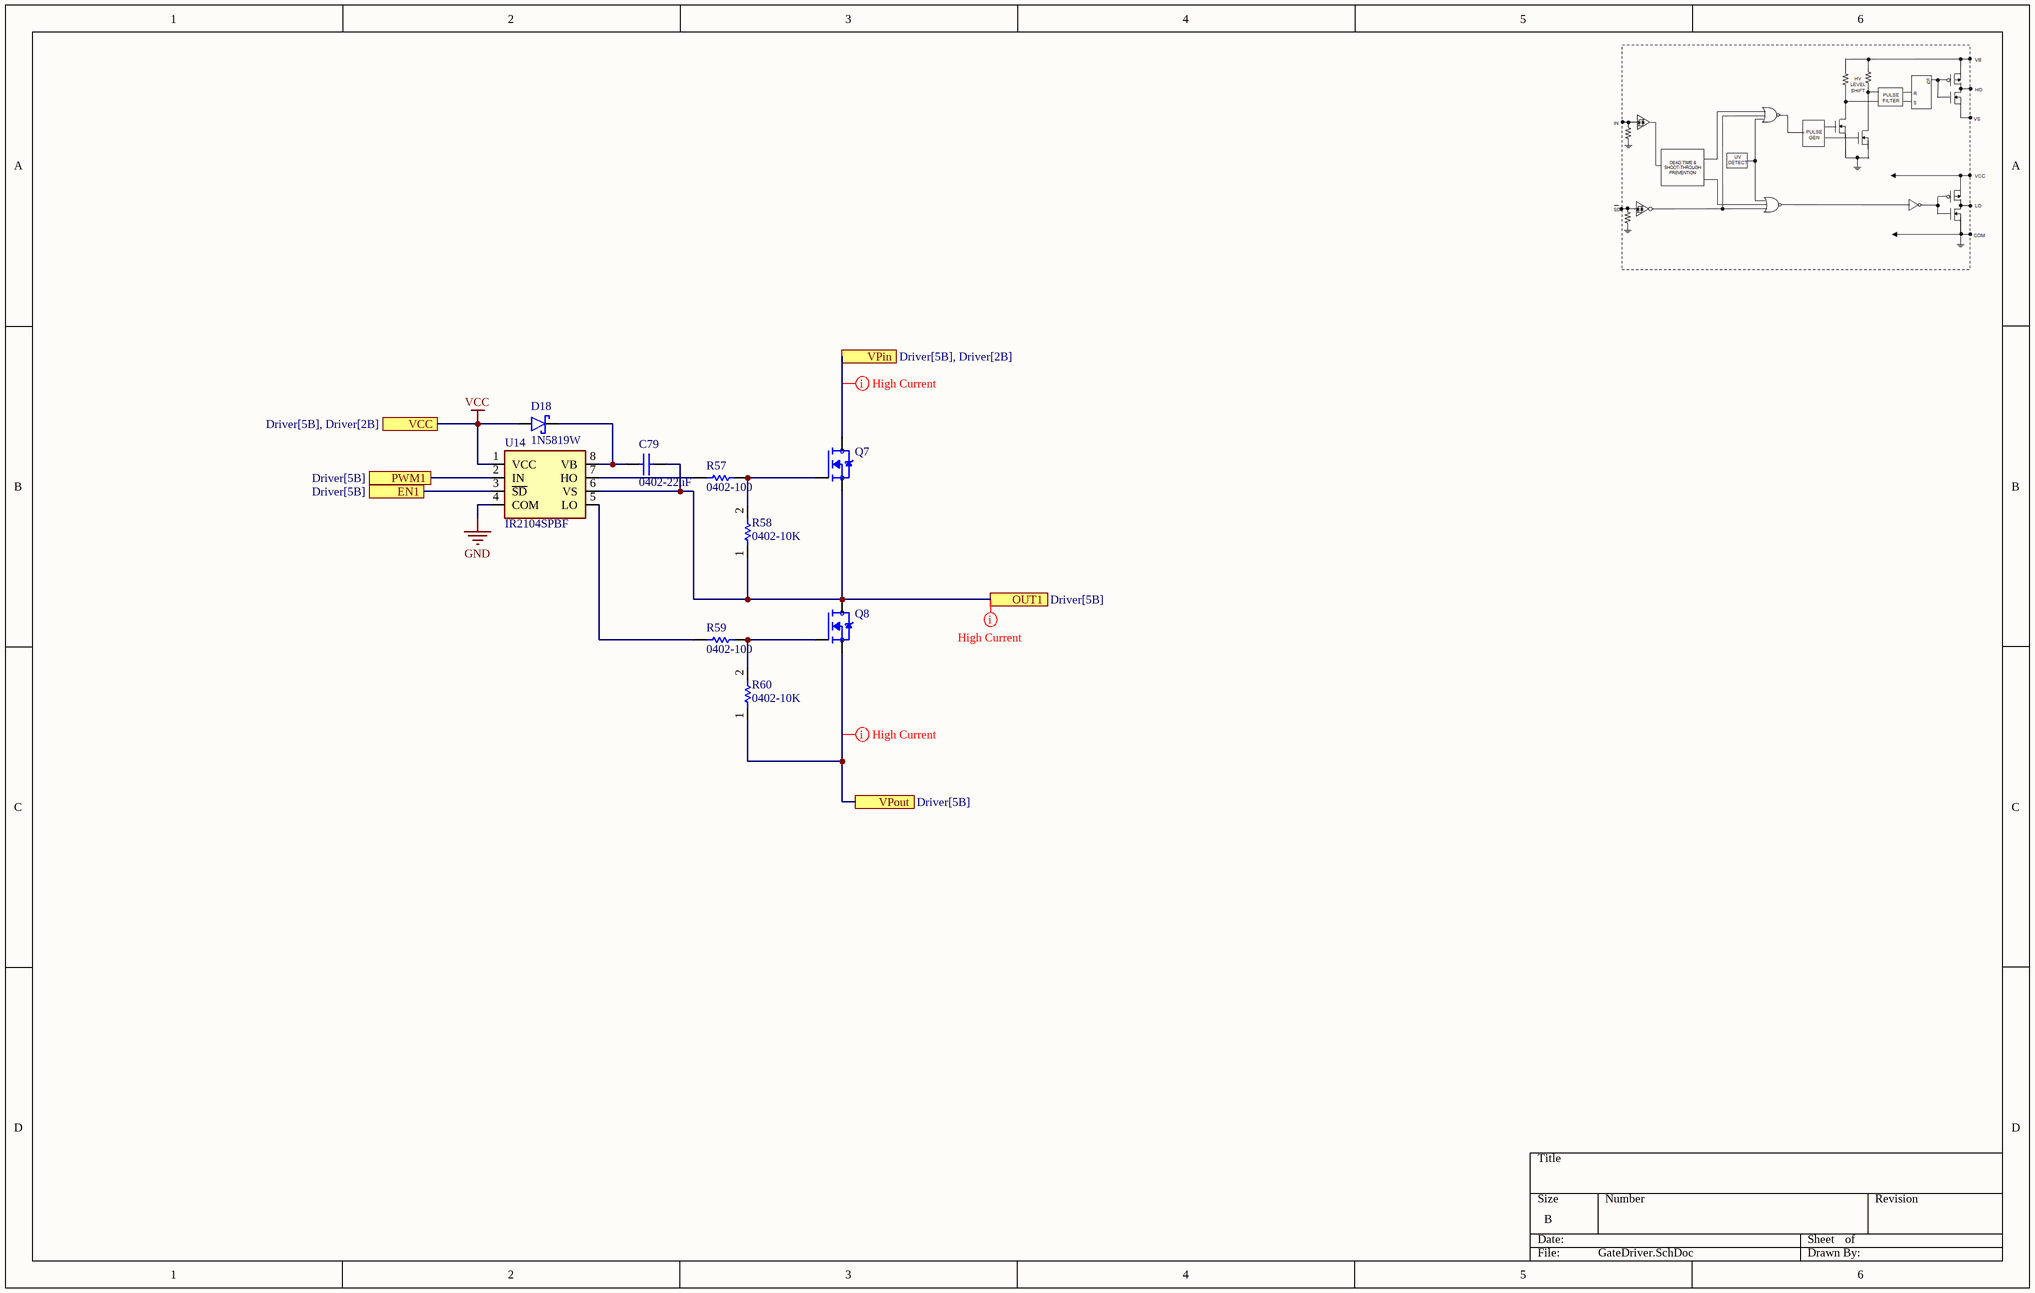
[diagram p14: GateDriver.SchDoc]

### Parts
C79  0402-22uF  [CAPC0402(1005)60_N]
D18  1N5819W  [1N5819W]
Q7  IRLR7843TRPBF  [TO229P990X239-3_4N]  (value not drawn)
Q8  IRLR7843TRPBF  [TO229P990X239-3_4N]  (value not drawn)
R57  0402-100  [R-0402-1K]
R58  0402-10K  [R-0402-10K]
R59  0402-100  [R-0402-1K]
R60  0402-10K  [R-0402-10K]
U14  IR2104SPBF  [IR2104SPBF]

### Ports
EN1 (see Driver[5B]), OUT1 (see Driver[5B]), PWM1 (see Driver[5B]), VCC (see Driver[5B], Driver[2B]), VPin (see Driver[5B], Driver[2B]), VPout (see Driver[5B])

### Nets
GND: U14.4(COM)
VCC: D18.A U14.1(VCC) ; port VCC
EN1: U14.3(~{SD}) ; port EN1
OUT1: C79.2 Q7.3(S) Q8.4(D) R58.1 U14.6(VS) ; port OUT1
PWM1: U14.2(IN) ; port PWM1
VPin: Q7.4(D) ; port VPin
VPout: Q8.3(S) R60.1 ; port VPout
NetC79_1: C79.1 D18.K U14.8(VB)
NetQ7_1: Q7.1(G) R57.2 R58.2
NetQ8_1: Q8.1(G) R59.2 R60.2
NetR57_1: R57.1 U14.7(HO)
NetR59_1: R59.1 U14.5(LO)

### Channels
U_TopLevelDesign/U_Driver/PhaseB: designators end in _PhaseB; ports EN1=NetU14_PhaseA_3 OUT1=NetC79_PhaseA_2 PWM1=NetU14_PhaseA_2 VCC=VCC VPin=NetQ7_PhaseA_4 VPout=NetQ8_PhaseA_3
U_TopLevelDesign/U_Driver/PhaseC: designators end in _PhaseC; ports EN1=NetU14_PhaseA_3 OUT1=NetC79_PhaseA_2 PWM1=NetU14_PhaseA_2 VCC=VCC VPin=NetQ7_PhaseA_4 VPout=NetQ8_PhaseA_3
U_TopLevelDesign/U_Driver/PhaseA: designators end in _PhaseA; ports EN1=NetU14_PhaseA_3 OUT1=NetC79_PhaseA_2 PWM1=NetU14_PhaseA_2 VCC=VCC VPin=NetQ7_PhaseA_4 VPout=NetQ8_PhaseA_3

### Layout directives
rule Width Constraint [Pref Width = 30mil    Min Width = 30mil    Max Width = 100mil]; net class Motor Power: NetC79_PhaseA_2, NetQ7_PhaseA_4, NetQ8_PhaseA_3

### Library data of the parts
C79 = CMP-001-00366-1: Capacitor 22uF 0402; Value: 22µF; Voltage Rating (DC): 4V; Tolerance: 20%; Dielectric: X5R; Construction: Flat; Max Operating Temperature: 85°C; Design Item ID: CMP-1034-02139-2; Case Code (Metric): 1005; Mount: Surface Mount; RoHS Compliant: Yes; Package Quantity: 1; Voltage Rating: 4V; Width: 0.02inch; Length: 0.039inch; Source: 0402-10uF.SchLib; Pins: 2; Packaging: Tape and Reel; Case/Package: 0402; Height: 0.5mm; Halogen Free: Halogen Free; Min Operating Temperature: -55°C; Thickness: 0.028inch; Series: M; Termination: SMD/SMT; Component Type: Standard
D18 = CMP-004-00113-1: Source: 1N5819W.SchLib; Design Item ID: 1N5819W; Pins: 2; Component Type: Standard
Q7 Q8 = CMP-123-000003-1: RoHS Compliant; MF: Infineon Technologies; Design Item ID: IRLR7843TRPBF; SnapEDA_Link: https://www.snapeda.com/parts/IRLR7843TRPBF/Infineon+Technologies/view-part/?ref=snap; Price: None; Package: TO-252-3 Infineon; Availability: In Stock; Purchase-URL: https://pricing.snapeda.com/search/part/IRLR7843TRPBF/?ref=eda; Check_prices: https://www.snapeda.com/parts/IRLR7843TRPBF/Infineon+Technologies/view-part/?ref=eda; Component Type: Standard; Source: IRLR7843TRPBF.SchLib; Pin Count: 3; MP: IRLR7843TRPBF; Value: *
R57 R59 = CMP-009-00677-3: 0402Resistor 100Ohm; Value: 100
R58 R60 = CMP-009-00675-4: RES 0402 10K; Value: 10k
U14 = CMP-031-00014-2: Half-Bridge Gate Driver IC Non-Inverting 8-SOIC; MF: Infineon; Pins: 8; Check_prices: https://www.snapeda.com/parts/IR2104SPBF/Infineon/view-part/?ref=eda; SnapEDA_Link: https://www.snapeda.com/parts/IR2104SPBF/Infineon/view-part/?ref=snap; Design Item ID: IR2104SPBF; Source: IR2104SPBF.SchLib; Component Type: Standard; Value: *; Case/Package: SOIC-8 Infineon; MP: IR2104SPBF

## Nets that join several sheets
3V3CS: U_TopLevelDesign/U_Driver/I_PhaseB (7 pins), U_TopLevelDesign/U_Driver/I_PhaseC (7 pins), U_TopLevelDesign/U_Driver/I_PhaseA (7 pins)
GND: TopLevelDesign (6 pins), U_TopLevelDesign/ESP_USB (13 pins), U_TopLevelDesign/STM_USB (13 pins), MCU (27 pins), OLED (24 pins), Wifi (40 pins), HiPowerProtect (6 pins), StepDown (27 pins), 5VProtect (7 pins), BattVoltSense (7 pins), U_TopLevelDesign/U_Driver/I_PhaseB (13 pins), U_TopLevelDesign/U_Driver/I_PhaseC (13 pins), U_TopLevelDesign/U_Driver/I_PhaseA (13 pins), BackEMF (26 pins), U_TopLevelDesign/U_Driver/PhaseB (U14_PhaseB.4), U_TopLevelDesign/U_Driver/PhaseC (U14_PhaseC.4), U_TopLevelDesign/U_Driver/PhaseA (U14_PhaseA.4)
MCU3V3: U_TopLevelDesign/ESP_USB (R42_ESP_USB.2 R43_ESP_USB.2), U_TopLevelDesign/STM_USB (R42_STM_USB.2 R43_STM_USB.2), MCU (14 pins)
USB5V: U_TopLevelDesign/ESP_USB (5 pins), U_TopLevelDesign/STM_USB (5 pins)
USB5V_Filted: U_TopLevelDesign/ESP_USB (C70_ESP_USB.2 FB5_ESP_USB.2), U_TopLevelDesign/STM_USB (C70_STM_USB.2 FB5_STM_USB.2)
VCC: U_TopLevelDesign/U_Driver/PhaseB (D18_PhaseB.A U14_PhaseB.1), U_TopLevelDesign/U_Driver/PhaseC (D18_PhaseC.A U14_PhaseC.1), U_TopLevelDesign/U_Driver/PhaseA (D18_PhaseA.A U14_PhaseA.1)
VinPower: StepDown (C51.1 U9.1), U_TopLevelDesign/U_Driver/I_PhaseB (R26_I_PhaseB.1 U7_I_PhaseB.2), U_TopLevelDesign/U_Driver/I_PhaseC (R26_I_PhaseC.1 U7_I_PhaseC.2), U_TopLevelDesign/U_Driver/I_PhaseA (R26_I_PhaseA.1 U7_I_PhaseA.2)
DR_N: U_TopLevelDesign/ESP_USB (R42_ESP_USB.1 R44_ESP_USB.2 R46_ESP_USB.2), U_TopLevelDesign/STM_USB (R42_STM_USB.1 R44_STM_USB.2 R46_STM_USB.2)
DR_P: U_TopLevelDesign/ESP_USB (R43_ESP_USB.1 R45_ESP_USB.2 R47_ESP_USB.2), U_TopLevelDesign/STM_USB (R43_STM_USB.1 R45_STM_USB.2 R47_STM_USB.2)
NetC43_I_PhaseA_2: U_TopLevelDesign/U_Driver/I_PhaseB (5 pins), U_TopLevelDesign/U_Driver/I_PhaseC (5 pins), U_TopLevelDesign/U_Driver/I_PhaseA (5 pins)
NetC79_PhaseA_2: U_TopLevelDesign/U_Driver/PhaseB (5 pins), U_TopLevelDesign/U_Driver/PhaseC (5 pins), U_TopLevelDesign/U_Driver/PhaseA (5 pins)
NetQ7_PhaseA_4: U_TopLevelDesign/U_Driver/PhaseB (Q7_PhaseB.4), U_TopLevelDesign/U_Driver/PhaseC (Q7_PhaseC.4), U_TopLevelDesign/U_Driver/PhaseA (Q7_PhaseA.4)
NetQ8_PhaseA_3: U_TopLevelDesign/U_Driver/PhaseB (Q8_PhaseB.3 R60_PhaseB.1), U_TopLevelDesign/U_Driver/PhaseC (Q8_PhaseC.3 R60_PhaseC.1), U_TopLevelDesign/U_Driver/PhaseA (Q8_PhaseA.3 R60_PhaseA.1)
NetR26_I_PhaseA_2: U_TopLevelDesign/U_Driver/I_PhaseB (R26_I_PhaseB.2 U7_I_PhaseB.3), U_TopLevelDesign/U_Driver/I_PhaseC (R26_I_PhaseC.2 U7_I_PhaseC.3), U_TopLevelDesign/U_Driver/I_PhaseA (R26_I_PhaseA.2 U7_I_PhaseA.3)
NetU14_PhaseA_2: U_TopLevelDesign/U_Driver/PhaseB (U14_PhaseB.2), U_TopLevelDesign/U_Driver/PhaseC (U14_PhaseC.2), U_TopLevelDesign/U_Driver/PhaseA (U14_PhaseA.2)
NetU14_PhaseA_3: U_TopLevelDesign/U_Driver/PhaseB (U14_PhaseB.3), U_TopLevelDesign/U_Driver/PhaseC (U14_PhaseC.3), U_TopLevelDesign/U_Driver/PhaseA (U14_PhaseA.3)